# Altium schematic sheet UI.SchDoc
size A3; DocumentNumber: 6; SheetNumber: 6; SheetTotal: 9
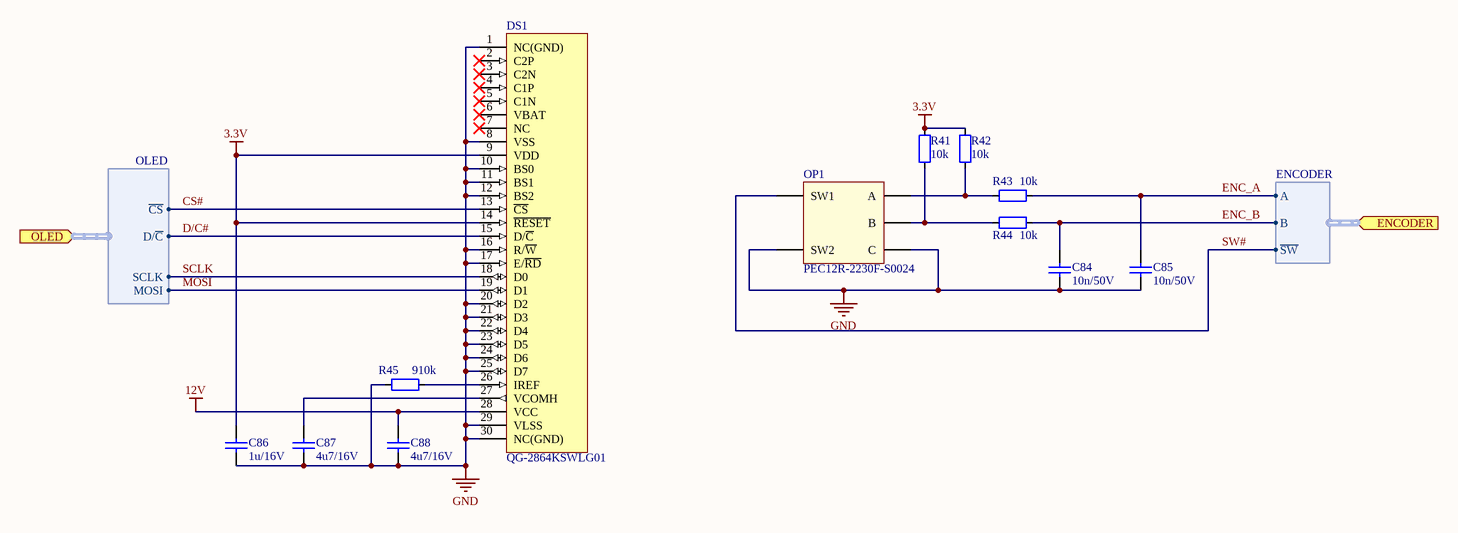
[diagram p0: UI.SchDoc]

## Parts
C84  10n/50V  [C0402]
C85  10n/50V  [C0402]
C86  1u/16V  [C0603]
C87  4u7/16V  [C0805]
C88  4u7/16V  [C0805]
DS1  QG-2864KSWLG01  [QG-2864KSWLG01]
OP1  PEC12R-2230F-S0024  [PEC12R-2x30F-Sxxxx]
R41  10k  [R0402]
R42  10k  [R0402]
R43  10k  [R0402]
R44  10k  [R0402]
R45  910k  [R0402]

## Ports
ENCODER (in, harness ENCODER), OLED (in, harness OLED)

## Harnesses
OLED: ~{CS}, D/~{C}, SCLK, MOSI
ENCODER: A, B, ~{SW}

## Nets
3.3V: C86.2 DS1.9(VDD) DS1.14(~{RESET}) R41.2 R42.2
12V: C88.2 DS1.28(VCC)
GND: C84.1 C85.1 C86.1 C87.1 C88.1 DS1.1(NC(GND)) DS1.8(VSS) DS1.10(BS0) DS1.11(BS1) DS1.12(BS2) DS1.16(R/~{W}) DS1.17(E/~{RD}) DS1.20(D2) DS1.21(D3) DS1.22(D4) DS1.23(D5) DS1.24(D6) DS1.25(D7) DS1.29(VLSS) DS1.30(NC(GND)) OP1.2(SW2) OP1.C R45.1
CS#: DS1.13(~{CS}) ; port OLED.~{CS}
D/C#: DS1.15(D/~{C}) ; port OLED.D/~{C}
ENC_A: C85.2 R43.2 ; port ENCODER.A
ENC_B: C84.2 R44.2 ; port ENCODER.B
MOSI: DS1.19(D1) ; port OLED.MOSI
SCLK: DS1.18(D0) ; port OLED.SCLK
SW#: OP1.1(SW1) ; port ENCODER.~{SW}
NetC87_2: C87.2 DS1.27(VCOMH)
NetDS1_26: DS1.26(IREF) R45.2
NetOP1_A: OP1.A R42.1 R43.1
NetOP1_B: OP1.B R41.1 R44.1

Not connected (* = marked no-connect by the designer): DS1 2(C2P)* 3(C2N)* 4(C1P)* 5(C1N)* 6(VBAT)* 7(NC)*

## Notes on the sheet
- Title
- Date:
- Number:
- Revision:
- Sheet
- of
- File:
- Author

## Library data of the parts
C84 C85 = 10n 50V X7R 0402: Manufacturer Part Number 1: 885012205067; Manufacturer 1: Wurth Elektronik; Voltage: 50V; Tolerance: 10%; Specifications: X7R 10n 50V ±10%; Capacitance: 10n; Dielectric: X7R; Supplier 1: Mouser; Supplier Part Number 1: 710-885012205067
C86 = 1u 16V X7R 0603: Manufacturer Part Number 1: 885012206052; Manufacturer 1: Wurth Elektronik; Voltage: 16V; Tolerance: 10%; Specifications: X7R 1u 16V ±10%; Capacitance: 1u; Dielectric: X7R; Supplier 1: Mouser; Supplier Part Number 1: 710-885012206052
C87 C88 = 4u7 16V X7R 0805: Manufacturer Part Number 1: EMK212AB7475KGHT; Manufacturer 1: Taiyo Yuden; Voltage: 16V; Tolerance: 10%; Specifications: X7R 4u7 16V ±10%; Capacitance: 4u7; Dielectric: X7R; Supplier 1: Mouser; Supplier Part Number 1: 963-EMK212AB7475KGHT
DS1 = QG-2864KSWLG01: OLED, 1.3-inch, 128x64, SPI; Manufacturer 1: Allvision Technology; Manufacturer Part Number: QG-2864KSWLG01; ComponentLink1Description: Datasheet; ComponentLink1URL: http://support.technologicalarts.ca/docs/Components/OLED13-SPI/1.3%20oled%20datasheet.pdf; Manufacturer Part Number 1: QG-2864KSWLG01
OP1 = PEC12R-2230F-S0024: Rotary Encoder Mechanical 24 Quadrature (Incremental) Right Angle; Manufacturer 1: Bourns; ComponentLink1Description: Datasheet; ComponentLink1URL: https://www.bourns.com/docs/Product-Datasheets/PEC12R.pdf; Supplier 1: Mouser; Supplier Part Number 1: 652-PEC12R-2230F-S24; Manufacturer Part Number 1: PEC12R-2230F-S0024
R41-R44 = 10k 63mW 50V 0402: Manufacturer Part Number 1: AC0402FR-0710KL; Manufacturer 1: Yageo; Power Rating: 63mW; Tolerance: 1%; Voltage: 50V; Resistance: 10k; Specifications: =Resistance+ ' '+"Power Rating "+Voltage+' ±'+Tolerance; Supplier 1: Mouser; Supplier Part Number 1: 603-AC0402FR-0710KL
R45 = 910k 63mW 50V 0402: Manufacturer Part Number 1: CRCW0402910KJNED; Manufacturer 1: Vishay; Power Rating: 63mW; Tolerance: 5%; Voltage: 50V; Resistance: 910k; Specifications: =Resistance+ ' '+"Power Rating "+Voltage+' ±'+Tolerance; Supplier 1: Mouser; Supplier Part Number 1: 71-CRCW0402910KJNED